# EAGLE design wirelessnode_triac (EAGLE 7.5.0)
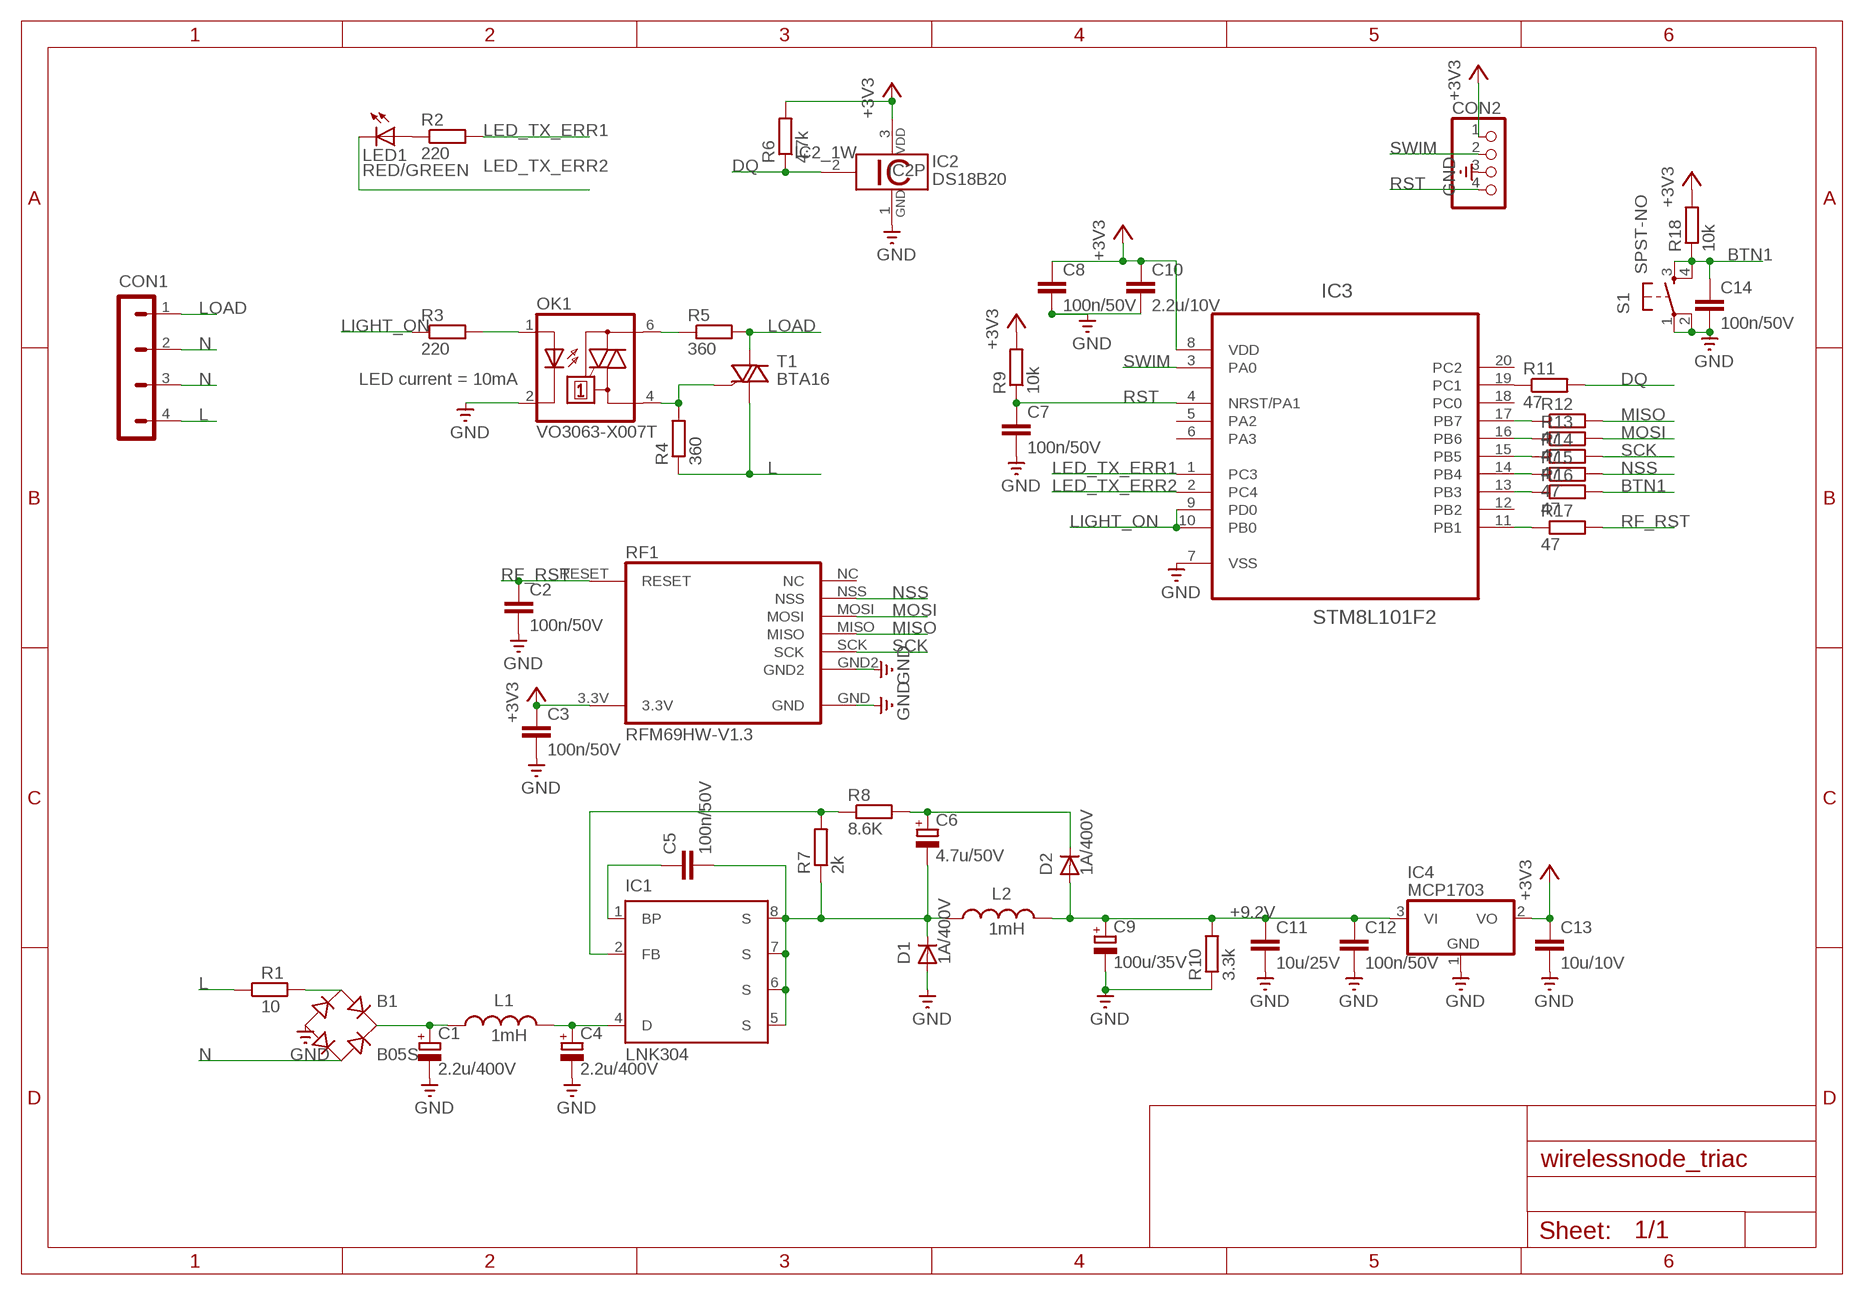
[diagram p0: schematic, sheet 1]

## Parts
B1  B05S  [MBS]
C1  2.2u/400V  C-POL-EUE3.5-8  [E3.5-8]
C2  100n/50V  C-EUC0603K  [C0603K]
C3  100n/50V  C-EUC0603K  [C0603K]
C4  2.2u/400V  C-POL-EUE3.5-8  [E3.5-8]
C5  100n/50V  C-EUC0603K  [C0603K]
C6  4.7u/50V  C-POL-EU  [PANASONIC_C_LARGER_PADS]
C7  100n/50V  C-EUC0603K  [C0603K]
C8  100n/50V  C-EUC0603K  [C0603K]
C9  100u/35V  C-POL-EUPANASONIC_D  [PANASONIC_D_LARGER_PADS]
C10  2.2u/10V  C-EUC0603K  [C0603K]
C11  10u/25V  C-EUC1206  [C1206]
C12  100n/50V  C-EUC0603K  [C0603K]
C13  10u/10V  C-EUC0603K  [C0603K]
C14  100n/50V  C-EUC0603K  [C0603K]
CON1  POWER_CONN_4  [TERMINAL_BLOCK_4]
CON2  ZL321-4P  CON_1X4PIN_1.27MM_SMD  [CON_1X4_1.27_SMD]
D1  1A/400V  US1G-DIO  [DO214-AC]
D2  1A/400V  SL1G  [SOD-123F]
IC1  LNK304  [SO8_NO_PIN3]
IC2  DS18B20  [TO92-]
IC3  STM8L101F2  [TSSOP20]
IC4  MCP1703  MCP1703CB  [SOT23]
L1  1mH  FERROCORE_DE0703-1000  [DE0703]
L2  1mH  FERROCORE_DE0703-1000  [DE0703]
LED1  RED/GREEN  LED5MM  [LED5MM]
OK1  VO3063-X007T  MOC3042S  [DIL6-SMD]
R1  10  R_CF1WS  [CF1WS]
R2  220  R-EU_R0603  [R0603]
R3  220  R-EU_R0603  [R0603]
R4  360  R-EU_R0603  [R0603]
R5  360  R-EU_R0603  [R0603]
R6  4.7k  R-EU_R0603  [R0603]
R7  2k  R-EU_R0603  [R0603]
R8  8.6K  R-EU_R0603  [R0603]
R9  10k  R-EU_R0603  [R0603]
R10  3.3k  R-EU_R0603  [R0603]
R11  47  R-EU_R0603  [R0603]
R12  47  R-EU_R0603  [R0603]
R13  47  R-EU_R0603  [R0603]
R14  47  R-EU_R0603  [R0603]
R15  47  R-EU_R0603  [R0603]
R16  47  R-EU_R0603  [R0603]
R17  47  R-EU_R0603  [R0603]
R18  10k  R-EU_R0603  [R0603]
RF1  RFM69HW-V1.3  [RFM69HW-V1.3-SMD]
S1  SPST-NO  DTSM-63X-V  [DTSM-63X-V-7MM_HEIGHT]
T1  BTA16  BT136SMD  [TO220_SMD]

## Nets
+3V3: C3.1 C8.1 C10.1 C13.1 CON2.1 IC2.3 IC3.8(VDD) IC4.2(VO) R6.2 R9.2 R18.2 RF1.3.3V
+9.2V: C9.+ C11.1 C12.1 D2.2(A) IC4.3(VI) L2.P$2 R10.2
BTN1: C14.1 R16.2 R18.1 S1.3(S) S1.4(S1)
DQ: IC2.2 R6.1 R11.2
GND: B1.- C1.- C2.2 C3.2 C4.- C7.2 C8.2 C9.- C10.2 C11.2 C12.2 C13.2 C14.2 CON2.3 D1.A IC2.1 IC3.7(VSS) IC4.1(GND) OK1.2(C) R10.1 RF1.GND RF1.GND2 S1.1(P) S1.2(P1)
L: CON1.4 R1.1 R4.1 T1.1(A1)
LED_TX_ERR1: IC3.1(PC3) R2.2
LED_TX_ERR2: IC3.2(PC4) LED1.K(C)
LIGHT_ON: IC3.9(PD0) IC3.10(PB0) R3.1
LOAD: CON1.1 R5.2 T1.2(A2)
MISO: R12.2 RF1.MISO
MOSI: R13.2 RF1.MOSI
N: B1.AC2 CON1.2 CON1.3
N$1: C4.+ IC1.4(D) L1.P$2
N$2: LED1.A R2.1
N$3: C6.+ D2.1(C) R8.2
N$4: IC1.2(FB) R7.2 R8.1
N$5: C5.1 IC1.1(BP)
N$6: C5.2 C6.- D1.C IC1.5(S) IC1.6(S) IC1.7(S) IC1.8(S) L2.P$1 R7.1
N$7: OK1.6(A2) R5.1
N$8: OK1.4(A1) R4.2 T1.3(G)
N$9: IC3.14(PB4) R15.1
N$10: B1.+ C1.+ L1.P$1
N$11: OK1.1(A) R3.2
N$12: B1.AC1 R1.2
N$13: IC3.15(PB5) R14.1
N$14: IC3.16(PB6) R13.1
N$15: IC3.17(PB7) R12.1
N$16: IC3.11(PB1) R17.1
N$17: IC3.13(PB3) R16.1
N$18: IC3.19(PC1) R11.1
NSS: R15.2 RF1.NSS
RF_RST: C2.1 R17.2 RF1.RESET
RST: C7.1 CON2.4 IC3.4(NRST/PA1) R9.1
SCK: R14.2 RF1.SCK
SWIM: CON2.2 IC3.3(PA0)
Unconnected: IC3.5(PA2) IC3.6(PA3) IC3.12(PB2) IC3.18(PC0) IC3.20(PC2) RF1.NC

## Notes on the sheet
- LED current = 10mA

## Library data of the parts
B1 = rectifier:B*S: Surface Mount Glass Passivated Bridge Rectifiers Source: Comchip Bridge Rectifiers B05S-G_B10S-G.pdf
C1 C4 = comp_wirelessnode:C-POL-EU; TME_ORDER_NUMBER: RD2G225M0811MBB
C2 C3 C5 C7 C8 C12 C14 = resistor:C-EU: CAPACITOR, European symbol; TME_ORDER_NUMBER: C0603C104K5RAC
C6 = comp_wirelessnode:C-POL-EU; TME_ORDER_NUMBER: RC1H475M05005VR
C9 = comp_wirelessnode:C-POL-EU; TME_ORDER_NUMBER: UCD1V101MCL6GS
C10 = resistor:C-EU: CAPACITOR, European symbol; TME_ORDER_NUMBER: CL10A225KP8NNNC
C11 = resistor:C-EU: CAPACITOR, European symbol; TME_ORDER_NUMBER: 08053D106KAT2A
C13 = resistor:C-EU: CAPACITOR, European symbol; TME_ORDER_NUMBER: 0603ZD106MAT2A
CON1 = CarReceiver:POWER_CONN_4; TME_ORDER_NUMBER: EBBA-02-C-SS-BU
CON2 = comp_wirelessnode:CON_1X4PIN_; TME_ORDER_NUMBER: ZL321-4P (DS1065-01-1X4S8BV)
D1 = comp_wirelessnode:US1G-DIO; TME_ORDER_NUMBER: US1G-DIO
D2 = comp_wirelessnode:SL1G; TME_ORDER_NUMBER: SL1G-DIO
IC1 = comp_wirelessnode:LNK304; TME_ORDER_NUMBER: LNK304DN
IC2 = 1wire:DS18B20: Programmable Resolution Digital Thermometer This chip provides a onewire thermosensor with approx. 0.5°C accuracy. A programmable over/undertemperure alarm is available. The precision can be set from 9..12 bits. Notes: Vdd must be applied for accurate measurements at low temperatures, as the parasite power circuit otherwise heats the sensor. If parasite power is used, Vdd has to be connected to GND. The DS1822 is a low-cost thermometer chip, the DS18S20 is similar to the DS18B20, but with 9 Bit precision only. Author: Jan Kandziora <jjj@gmx.de>
IC3 = comp_wirelessnode:STM8L101F2; TME_ORDER_NUMBER: STM8L101F2P6
IC4 = linear:MCP1703: 250 mA, 16V, Low Quiescent Current LDO Regulator Source: http://ww1.microchip.com/downloads/en/DeviceDoc/22049b.pdf; TME_ORDER_NUMBER: MCP1703T3302ECB
L1 L2 = comp_wirelessnode:FERROCORE_DE0703-1000: FERROCORE SMD Power Coil; TME_ORDER_NUMBER: DE0703-1000
LED1 = led:LED: LED OSRAM: - CHIPLED LG R971, LG N971, LY N971, LG Q971, LY Q971, LO R971, LY R971 LH N974, LH R974 LS Q976, LO Q976, LY Q976 LO Q996 - Hyper CHIPLED LW Q18S LB Q993, LB Q99A, LB R99A - SideLED LS A670, LO A670, LY A670, LG A670, LP A670 LB A673, LV A673, LT A673, LW A673 LH A674 LY A675 LS A676, LA A676, LO A676, LY A676, LW A676 LS A679, LY A679, LG A679 - Hyper Micro SIDELED® LS Y876, LA Y876, LO Y876, LY Y876 LT Y87S - SmartLED LW L88C, LW L88S LB L89C, LB L89S, LG L890 LS L89K, LO L89K, LY L89K LS L896, LA L896, LO L896, LY L896 - TOPLED LS T670, LO T670, LY T670, LG T670, LP T670 LSG T670, LSP T670, LSY T670, LOP T670, LYG T670 LG T671, LOG T671, LSG T671 LB T673, LV T673, LT T673, LW T673 LH T674 LS T676, LA T676, LO T676, LY T676, LB T676, LH T676, LSB T676, LW T676 LB T67C, LV T67C, LT T67C, LS T67K, LO T67K, LY T67K, LW E67C LS E67B, LA E67B, LO E67B, LY E67B, LB E67C, LV E67C, LT E67C LW T67C LS T679, LY T679, LG T679 LS T770, LO T770, LY T770, LG T770, LP T770 LB T773, LV T773, LT T773, LW T773 LH T774 LS E675, LA E675, LY E675, LS T675 LS T776, LA T776, LO T776, LY T776, LB T776 LHGB T686 LT T68C, LB T68C - Hyper Mini TOPLED® LB M676 - Mini TOPLED Santana® LG M470 LS M47K, LO M47K, LY M47K Source: http://www.osram.convergy.de LUXEON: - LUMILED® LXK2-PW12-R00, LXK2-PW12-S00, LXK2-PW14-U00, LXK2-PW14-V00 LXK2-PM12-R00, LXK2-PM12-S00, LXK2-PM14-U00 LXK2-PE12-Q00, LXK2-PE12-R00, LXK2-PE12-S00, LXK2-PE14-T00, LXK2-PE14-U00 LXK2-PB12-K00, LXK2-PB12-L00, LXK2-PB12-M00, LXK2-PB14-N00, LXK2-PB14-P00, LXK2-PB14-Q00 LXK2-PR12-L00, LXK2-PR12-M00, LXK2-PR14-Q00, LXK2-PR14-R00 LXK2-PD12-Q00, LXK2-PD12-R00, LXK2-PD12-S00 LXK2-PH12-R00, LXK2-PH12-S00 LXK2-PL12-P00, LXK2-PL12-Q00, LXK2-PL12-R00 Source: www.luxeon.com KINGBRIGHT: KA-3528ASYC Source: www.kingbright.com; TME_ORDER_NUMBER: L-57EGW
OK1 = optocoupler:MOC30*: 6-Pin DIP Zero-Cross Optoisolators Triac Driver Output (250/400 Volt Peak) Source: Data sheet <http://www.fairchildsemi.com/ds/MO/MOC3031M.pdf> The old path of data sheet not more available 2013-05-06.; MF: FAIRCHILD SEMICONDUCTOR; MPN: MOC3042SM; OC_FARNELL: unknown; OC_NEWARK: 34C1339; TME_ORDER_NUMBER: VO3063-X007T
R1 = comp_wirelessnode:R_; TME_ORDER_NUMBER: CF1WS-10R
R2-R6 R9 R11-R18 = resistor:R-EU_: RESISTOR, European symbol
R7 = resistor:R-EU_: RESISTOR, European symbol; TME_ORDER_NUMBER: RC0603FR-072K
R8 = resistor:R-EU_: RESISTOR, European symbol; TME_ORDER_NUMBER: CRCW06038K66FKTABC
R10 = resistor:R-EU_: RESISTOR, European symbol; TME_ORDER_NUMBER: RC0603FR-073K3
RF1 = comp_wirelessnode:RFM69HW-V1.3; TME_ORDER_NUMBER: RFM69HW-868S2
S1 = comp_wirelessnode:DTSM-63X-V; TME_ORDER_NUMBER: DTSM-63N-V-B
T1 = comp_wirelessnode:BT136; TME_ORDER_NUMBER: BTA16-600BRG

## Net classes
0 default: clearance 0.205 mm

## Board
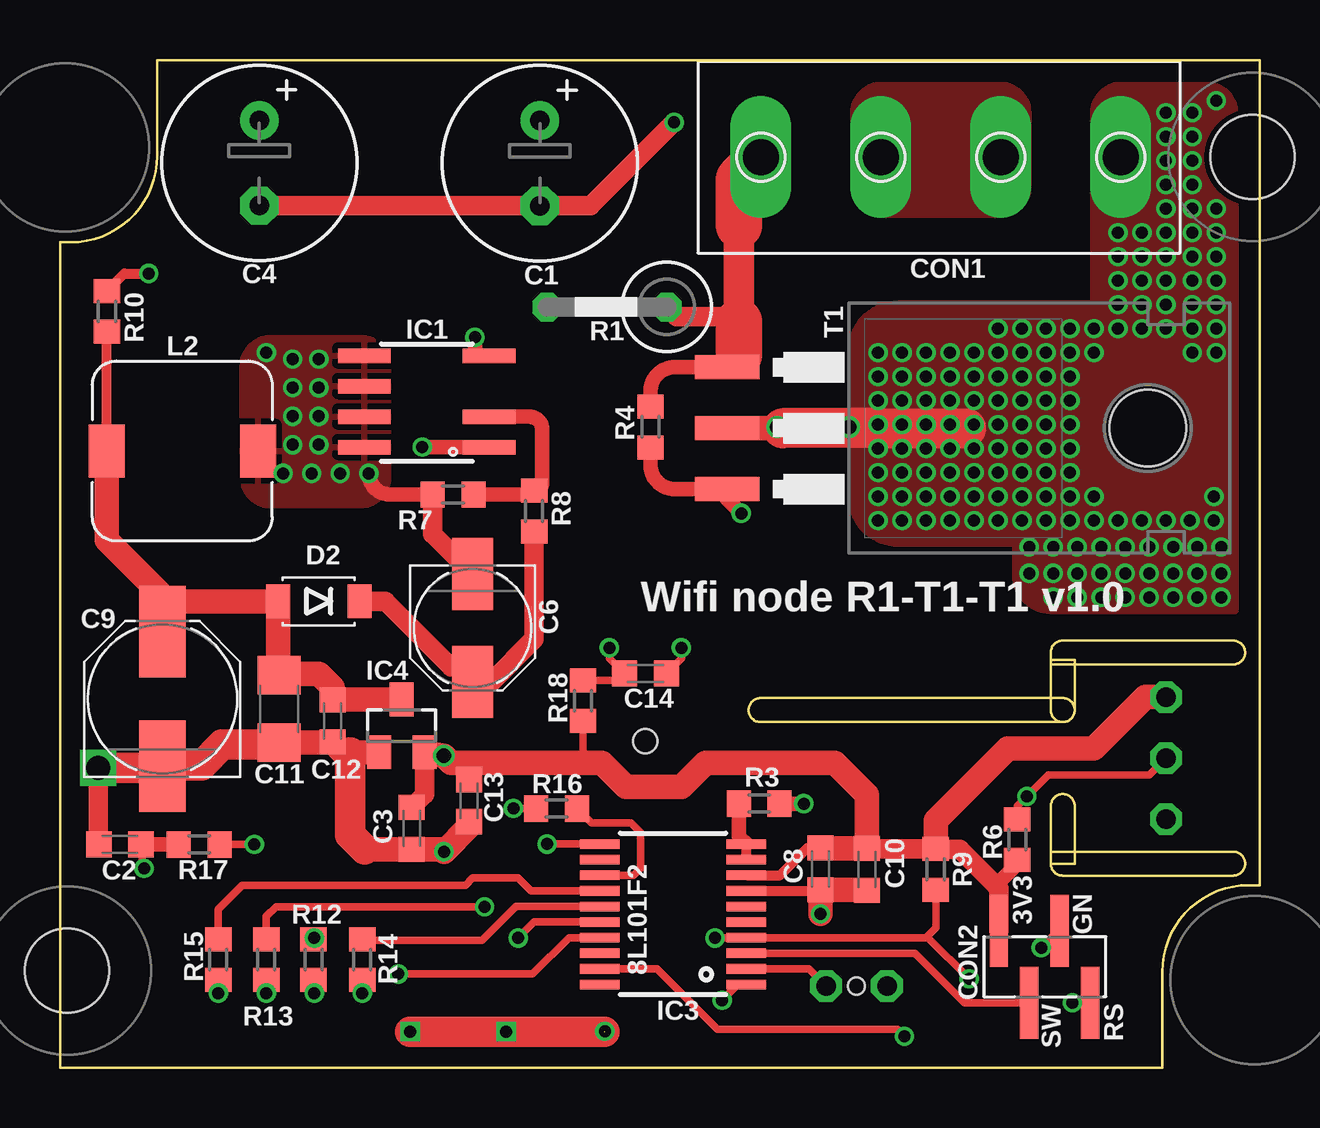
[diagram p1: board, top side]
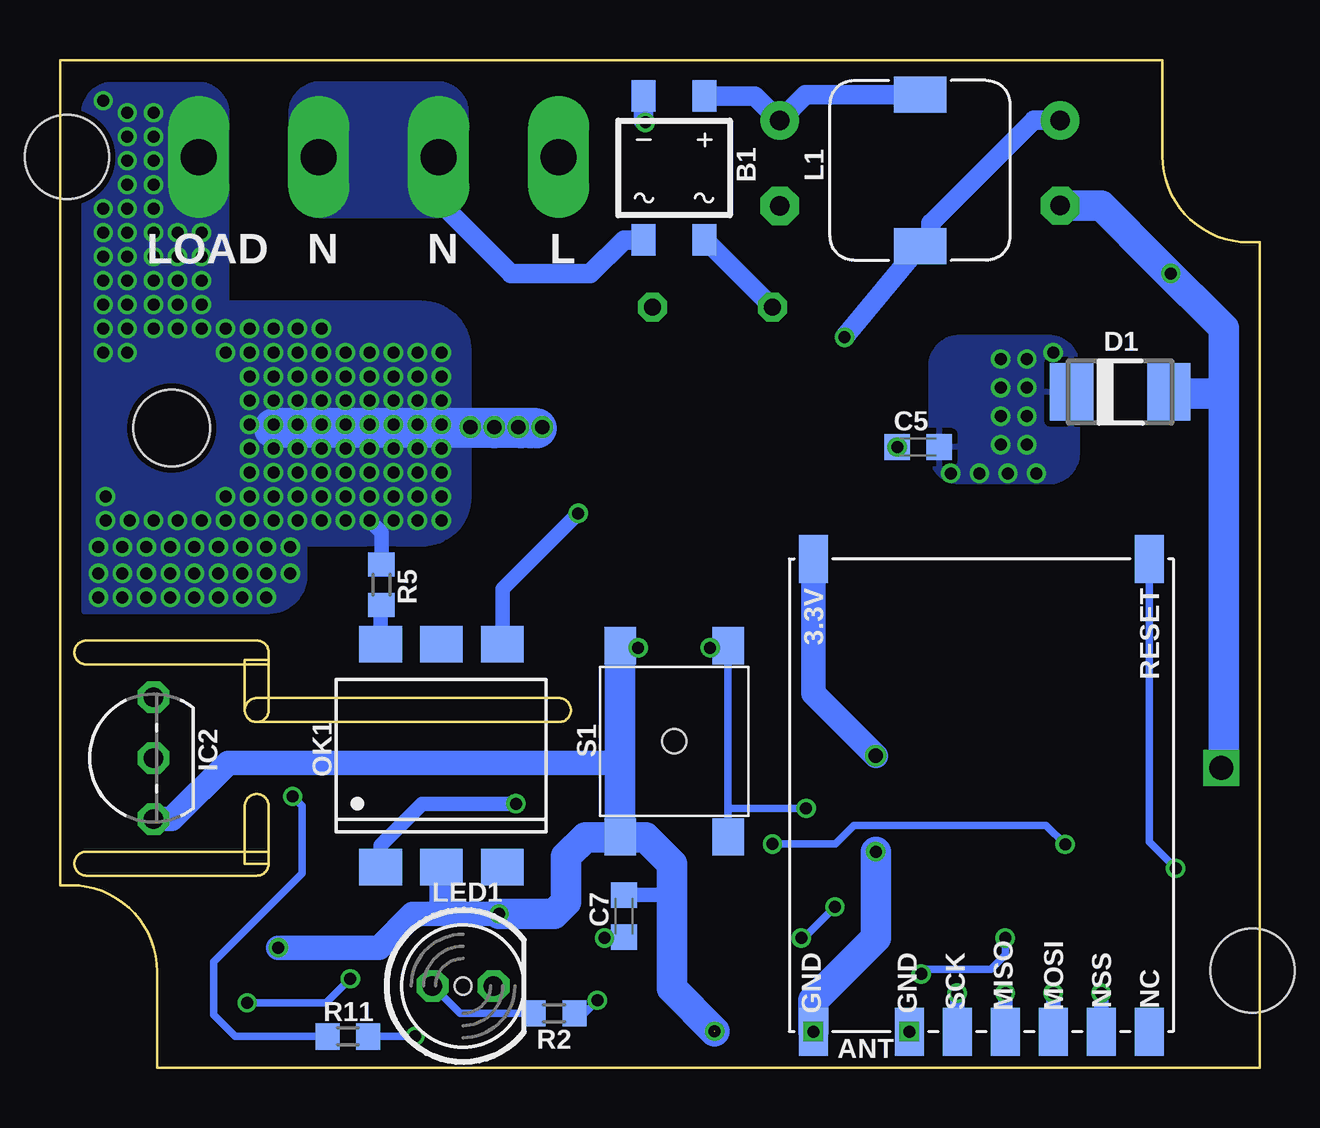
[diagram p2: board, bottom side, seen from below]

Size 50 x 42 mm. Coordinates in mm from the lower left corner, seen from the top.
Outline: 4.05,42 4.05,38 arc-90 0.45,34.4 0,34.4 0,0 45.95,0 45.95,4 arc-90 49.55,7.6 50,7.6 50,42 4.05,42
Copper layers (1*16): Top 0.035mm / dielectric 1.5mm / Bottom 0.035mm
Design rules "SeeedStudio_2layer_DRU_no_angle_20140221": minimum track width 6mil, minimum drill 12mil, track to track 6mil, track to pad 6mil, pad to pad 6mil, via to via 6mil, smd to smd 0mil, copper to edge 10mil, drill to drill 10mil, minimum pad ring 10mil, minimum via ring 6mil, stop-mask expansion 2mil, vias tented up to drill 100mil, thermal gap 10mil
Holes 3.5 mm at 49.7,37.95 0.3,4.05
Holes 1 mm at 24.4,13.6
Holes 0.7 mm at 33.2,3.4
Milling: area 41.3,16.8 to 49.4,17.8; area 41.3,14.4 to 42.3,17; area 41.3,8 to 49.4,9; area 41.3,8.5 to 42.3,11.4; area 28.7,14.4 to 42.3,15.4

### Footprints (pad centres in the part's own frame; a part is rotated, then mirrored left to right if it is on the bottom)
MBS = smd 1 x 1.3: + -1.27,-3; - 1.27,-3; AC1 -1.27,3; AC2 1.27,3
E3.5-8 = drill 0.813 pad 1.6: + -1.778,0 | drill 0.813 pad 1.6 octagon: - 1.778,0
C0603K = smd 1.05 x 1.08: 1 -0.875,0; 2 0.875,0
PANASONIC_C_LARGER_PADS = smd 3 x 1.7: + 2.25,0; - -2.25,0
PANASONIC_D_LARGER_PADS = smd 3.81 x 1.93: + 2.8,0; - -2.8,0
C1206 = smd 1.6 x 1.8: 1 -1.4,0; 2 1.4,0
TERMINAL_BLOCK_4 = drill 1.5 pad 2.54 long: 1 0,7.58; 2 0,2.58; 3 0,-2.42; 4 0,-7.42
CON_1X4_1.27_SMD = smd 0.76 x 3: 1 -1.27,1.5; 2 0,-1.5; 3 1.27,1.5; 4 2.54,-1.5
DO214-AC = smd 1.8 x 2.4: A 2.025,0; C -2.025,0
SOD-123F = smd 1 x 1.4: 1 -1.7,0; 2 1.7,0
SO8_NO_PIN3 = smd 0.6 x 2.2: 1 -1.905,-2.6; 2 -0.635,-2.6; 4 1.905,-2.6; 5 1.905,2.6; 6 0.635,2.6; 7 -0.635,2.6; 8 -1.905,2.6
TO92- = drill 0.813 octagon: 1 -2.54,0; 2 0,0; 3 2.54,0
TSSOP20 = smd 0.4 x 1.65: 1 -3.575,-3.05; 2 -2.925,-3.05; 3 -2.275,-3.05; 4 -1.625,-3.05; 5 -0.975,-3.05; 6 -0.325,-3.05; 7 0.325,-3.05; 8 0.975,-3.05; 9 1.625,-3.05; 10 2.275,-3.05; 11 2.275,3.05; 12 1.625,3.05; 13 0.975,3.05; 14 0.325,3.05; 15 -0.325,3.05; 16 -0.975,3.05; 17 -1.625,3.05; 18 -2.275,3.05; 19 -2.925,3.05; 20 -3.575,3.05
SOT23 = smd 1 x 1.4: 1 -0.95,-1.1; 2 0.95,-1.1; 3 0,1.1
DE0703 = smd 2.2 x 1.5: P$1 0,3.15; P$2 0,-3.15
LED5MM = drill 0.813 octagon: A -1.27,0; K 1.27,0
DIL6-SMD = smd 1.78 x 1.52: 1 -2.54,-4.645; 2 0,-4.645; 3 2.54,-4.645; 4 2.54,4.645; 5 0,4.645; 6 -2.54,4.645
CF1WS = drill 0.7 octagon: 1 0,0; 2 5,0
R0603 = smd 1 x 1.1: 1 -0.85,0; 2 0.85,0
RFM69HW-V1.3-SMD = smd 2 x 1.2: 3.3V 0,1; GND 19.7,1; GND2 19.7,5; MISO 19.7,9; MOSI 19.7,11; NC 19.7,15; NSS 19.7,13; RESET 0,15; SCK 19.7,7
DTSM-63X-V-7MM_HEIGHT = smd 1.55 x 1.3: 1 -3.987,2.25; 2 3.987,2.25; 3 -3.987,-2.25; 4 3.987,-2.25
TO220_SMD = smd 1 x 2.7: 1 -2.54,-7.72; 2 0,-7.72; 3 2.54,-7.72 | hole 3.2: 0,9.806

### Placement (x,y rotation side)
B1  24.4,37.5 180 bottom
C1  20,37.7 270 top
C2  2.5,9.3 180 top
C3  14.66,9.97 270 top
C4  8.31,37.71 270 top
C5  14.23,25.86 0 bottom
C6  17.2,18.32 270 top
C7  26.49,6.32 90 bottom
C8  31.7,8.28 270 top
C9  4.27,15.36 90 top
C10  33.63,8.26 270 top
C11  9.13,14.95 270 top
C12  11.36,14.45 270 top
C13  17.05,11.13 270 top
C14  24.4,16.43 0 top
CON1  36.63,37.95 270 top
CON2  40.4,4.2 0 top
D1  5.81,28.16 0 bottom
D2  10.78,19.43 180 top
IC1  15.29,27.77 90 top
IC2  46.1,12.9 90 bottom
IC3  25.55,7.04 90 top
IC4  14.24,14.24 0 top
L1  14.15,37.4 0 bottom
L2  5.1,25.7 270 top
LED1  33.2,3.4 0 bottom
OK1  34.1,13 0 bottom
R1  25.3,31.7 180 top
R2  29.41,2.26 0 bottom
R3  29.14,11.01 0 top
R4  24.61,26.7 270 top
R5  36.6,20.12 90 bottom
R6  39.9,9.5 270 top
R7  16.39,23.89 0 top
R8  19.77,23.2 270 top
R9  36.5,8.26 90 top
R10  1.96,31.52 270 top
R11  38,1.3 180 bottom
R12  10.57,4.5 270 top
R13  8.6,4.5 270 top
R14  12.6,4.5 270 top
R15  6.6,4.5 270 top
R16  20.7,10.8 180 top
R17  5.8,9.3 180 top
R18  21.8,15.29 270 top
RF1  19.6,21.2 270 bottom
S1  24.4,13.6 90 bottom
T1  35.53,26.65 270 top

### Tracks (layer width: path | path; a pad name or v marks a point on that pad's centre or on a via)
+3V3  (via drill 0.6)
  Top 0.305: R18.2 21.8,12.7
  Top 0.406: IC3.8 30.02,8.02 31.15,9.15 C8.1
  Top 0.61: R6.2 39.9,8.5 39,7.6
  Top 0.813: IC4.2 15.19,11.38 C3.1 | C10.1 33.66,9.11 R9.2 37.5,9.1 39,7.6 39.13,7.47 CON2.1
  Top 1.016: IC4.2 v16,13 16.3,12.7 17.1,12.7 | 17.1,12.7 21.8,12.7 22.6,12.7 23.6,11.7 25.9,11.7 26.9,12.7 32.3,12.7 33.63,11.37 C10.1 31.72,9.14 C8.1 | C13.1 17.05,12.65 17.1,12.7 | IC2.3 45.24,15.44 43.1,13.3 39.5,13.3 36.5,10.3 R9.2
  Bottom 1.016: RF1.3.3V 18.6,15.6 v16,13
+9.2V
  Top 0.406: L2.P$2 R10.2
  Top 0.61: C9.+ 4.34,19.06 4.34,19.27 4.5,19.43
  Top 1.016: IC4.3 11.38,15.34 C12.1 11.36,15.84 10.8,16.4 9.19,16.4 C11.1 9.08,16.35 D2.2 4.5,19.43 1.95,21.98 L2.P$2
BTN1  (via drill 0.5)
  Top 0.305: v18.9,10.8 R16.2 | v22.9,17.5 22.9,17.05 C14.1 23.25,16.14 R18.1
  Bottom 0.305: 22.15,10.8 S1.4 22.81,17.59 v22.9,17.5 | 22.15,10.8 S1.3 22.15,9.4 | v18.9,10.8 22.15,10.8
DQ  (via drill 0.5)
  Top 0.305: IC2.2 45.4,12.2 41.2,12.2 v40.3,11.3 39.9,10.9 R6.1
  Bottom 0.305: R11.2 42.7,1.3 43.6,2.2 43.6,4.4 39.9,8.1 39.9,10.9 v40.3,11.3
GND  (via drill 0.5, 1)  (1 unrouted)
  Top 0.305: CON2.3 41.6,5.7 v40.9,5 | C14.2 25.9,17.05 v25.9,17.5
  Top 0.406: IC4.1 13.29,13.19 13.3,13.2 | R10.1 2.69,33.1 v3.7,33.1 | IC3.7 31.36,7.37 C8.2
  Top 0.813: v1.6,12.5 1.6,9.32 C2.2 | C4.- C1.- 22.12,35.92 v25.6,39.4
  Top 1.016: 9.05,13.46 C11.2 11.33,13.55 C12.2 11.79,13.14 12.1,13.14 IC4.1 | 12.7,9.1 C3.2 15.9,9.1 v16,9 17.05,10.05 C13.2 | v31.7,6.4 C8.2 33.61,7.4 C10.2
  Top 1.27: 9.05,13.46 6.76,13.46 5.9,12.6 4.31,12.6 C9.- | v1.6,12.5 4.21,12.5 | 12.7,9.1 12.1,9.7 12.1,13.14 | RF1.GND2 RF1.GND v22.7,1.5
  Top 1.422: 4.21,12.5 C9.-
  Bottom 0.305: S1.2 25.99,17.59 v25.9,17.5
  Bottom 0.406: v3.7,33.1 4.16,33.56 4.24,33.56
  Bottom 0.61: 1.49,22.04 1.49,22.1 | C7.2 24.51,7.19 24.5,7.2
  Bottom 0.813: B1.- 25.67,39.47 v25.6,39.4
  Bottom 1.016: 26.69,9.65 S1.1 | v31.7,6.4 34.1,6.4 | 34.1,6.4 35.3,6.4 36.7,5 v40.9,5 | OK1.2 34.1,6.4 | IC2.1 45.34,10.36 43,12.7 26.65,12.7 | 26.75,13 26.65,12.9
  Bottom 1.27: 1.49,28.1 1.49,22.1 1.49,12.61 v1.6,12.5 | 1.49,28.1 1.49,30.82 4.24,33.56 6.6,35.93 C4.- | D1.A 3.72,28.1 1.49,28.1 | S1.2 26.65,12.9 26.65,12.7 S1.1 | v16,9 16,5.4 18.6,2.8 RF1.GND | v22.71,1.51 24.5,3.3 24.5,7.2 24.5,8.5 25.6,9.6 26.64,9.6 S1.1 | v31.7,6.4 29.4,6.4 28.9,6.9 28.9,8.8 28.1,9.6 26.66,9.6 S1.1
  other vias: 14.6,1.5 18.6,1.5
L
  Top 0.61: T1.1 25.61,29.19 arc90 24.61,28.19 R4.1
  Top 0.813: 28.3,29.69 28.3,29.19 T1.1 | R1.1 25.7,31.3 28.3,31.3
  Top 1.27: 28.3,35.1 28.3,31.3 28.3,31.1
  Top 1.93: CON1.4 28.3,37.04 28.3,35.1 | 28.3,31.1 28.3,29.69
LED_TX_ERR1  (via drill 0.5)
  Top 0.305: IC3.1 28.27,3.46 v27.6,2.8
  Bottom 0.305: v27.6,2.8 28.14,2.26 R2.2
LED_TX_ERR2
  Top 0.305: IC3.2 31.21,4.12 LED1.K
LIGHT_ON
  Top 0.406: IC3.9 IC3.10
  Top 0.61: IC3.10 28.3,9.62 R3.1
LOAD  (via drill 0.5, 0.6)
  Top 1.016: 34.17,26.63 arc-90 34.2,26.65 | 30.12,26.65 T1.2 arc-90 T1.2
  Top 1.676: 37.77,26.65 34.2,26.65 34.15,26.65 30.12,26.65
  Bottom 0.61: R5.2 36.6,22.3 v37.1,22.8 | v31.9,26.7 31.9,26.65 | v30.9,26.7 arc45 30.81,26.66 30.8,26.65 | v29.9,26.7 29.9,26.65 30.39,26.65 arc45 30.4,26.65
  Bottom 1.676: 30.12,26.65 30.4,26.65 30.8,26.65 31.9,26.65 41.07,26.65
  other vias: 34.1,29.8 35.1,29.8 36.1,29.8 37.1,29.8 38.1,29.8 39.1,29.8 40.1,29.8 41.1,29.8 42.1,29.8 34.1,28.8 35.1,28.8 36.1,28.8 37.1,28.8 38.1,28.8 39.1,28.8 40.1,28.8 41.1,28.8 42.1,28.8 34.1,27.8 35.1,27.8 36.1,27.8 37.1,27.8 38.1,27.8 39.1,27.8 40.1,27.8 41.1,27.8 42.1,27.8 34.1,26.8 35.1,26.8 36.1,26.8 37.1,26.8 38.1,26.8 39.1,26.8 40.1,26.8 41.1,26.8 42.1,26.8 34.1,25.8 35.1,25.8 36.1,25.8 37.1,25.8 38.1,25.8 39.1,25.8 40.1,25.8 41.1,25.8 42.1,25.8 34.1,24.8 35.1,24.8 36.1,24.8 37.1,24.8 38.1,24.8 39.1,24.8 40.1,24.8 41.1,24.8 42.1,24.8 34.1,23.8 35.1,23.8 36.1,23.8 37.1,23.8 38.1,23.8 39.1,23.8 40.1,23.8 41.1,23.8 42.1,23.8 34.1,22.8 35.1,22.8 36.1,22.8 38.1,22.8 39.1,22.8 40.1,22.8 41.1,22.8 42.1,22.8 40.4,21.7 41.4,21.7 42.4,21.7 43.4,21.7 44.4,21.7 45.4,21.7 46.4,21.7 47.4,21.7 48.4,21.7 40.4,20.6 41.4,20.6 42.4,20.6 43.4,20.6 44.4,20.6 45.4,20.6 46.4,20.6 47.4,20.6 41.4,19.6 42.4,19.6 43.4,19.6 44.4,19.6 45.4,19.6 46.4,19.6 47.4,19.6 48.4,20.6 48.4,19.6 43.1,22.8 44.1,22.8 43.1,23.8 42.1,30.8 41.1,30.8 40.1,30.8 39.1,30.8 43.1,29.8 43.1,30.8 44.1,30.8 48.1,22.8 47.2,30.8 45.1,30.8 46.1,30.8 48.1,23.8 47.1,22.8 46.1,22.8 45.1,22.8 48.2,30.8 48.2,29.8 47.2,29.8 44.1,32.8 45.1,32.8 46.1,32.8 47.2,32.8 48.2,32.8 48.2,31.8 47.2,31.8 46.1,31.8 45.1,31.8 44.1,31.8 44.1,33.8 45.1,33.8 46.1,33.8 47.2,33.8 48.2,33.8 48.2,34.8 47.2,34.8 46.1,34.8 45.1,34.8 46.1,35.8 47.2,35.8 48.2,35.8 47.2,36.8 46.1,36.8 46.1,37.8 47.2,37.8 47.2,38.8 48.2,40.3 47.2,39.8 46.1,39.8 46.1,38.8 44.1,34.8 32.9,26.7
  pour Bottom: 47.97,31.88 34.95,31.88 arc90 32.95,29.88 32.95,23.8 arc90 34.95,21.8 39.8,21.8 39.8,20.5 arc90 41.3,19 49,19 49,30.88 arc90
  pour Top: 49,30.88 49,19 41.3,19 arc-90 39.8,20.5 39.8,21.8 34.95,21.8 arc-90 32.95,23.8 32.95,29.88 arc-90 34.95,31.88 47.97,31.88 arc-90
  pour Top (no thermals): 43.05,30.5 43.05,39.8 arc-90 44.25,41 47.8,41 arc-90 49,39.8 49,30.5
  pour Bottom (no thermals): 49,30.5 49,39.8 arc90 47.8,41 44.25,41 arc90 43.05,39.8 43.05,30.5
MISO  (via drill 0.5)
  Top 0.61: R12.2 10.57,3.13 v10.6,3.1
  Bottom 0.61: RF1.MISO v10.6,3.1
MOSI  (via drill 0.5)
  Top 0.61: R13.2 v8.6,3.1
  Bottom 0.61: RF1.MOSI v8.6,3.1
N
  Bottom 0.813: CON1.3 34.21,36.11 31.2,33.1 27.9,33.1 26.5,34.5 B1.AC2
  pour Bottom (no thermals): 40.38,39.8 40.38,36.72 arc-90 39.18,35.52 34.25,35.52 arc-90 33.05,36.72 33.05,39.8 arc-90 34.25,41 39.18,41 arc-90
  pour Top (no thermals): 40.38,39.8 40.38,36.72 arc-90 39.18,35.52 34.25,35.52 arc-90 33.05,36.72 33.05,39.8 arc-90 34.25,41 39.18,41 arc-90
N$1  (via drill 0.5 pad 0.81)
  Top 0.61: v17.29,30.44 17.29,29.67 IC1.4
  Bottom 0.813: 14.1,34.3 L1.P$2 | L1.P$2 v17.29,30.44 | C4.+ 9.41,39.48 13.7,35.2 13.7,34.7 L1.P$2
N$2
  Bottom 0.305: R2.1 33.33,2.26 LED1.A
N$3
  Top 0.813: R8.2 19.77,17.87 18,16.1 17.23,16.1 C6.+ 16.57,16.7 16.3,16.7 13.57,19.43 D2.1
N$4
  Top 0.61: 19.87,23.86 R8.1 | 19.85,24.05 R8.1 | R7.2 19.6,23.89 R8.1 | IC1.2 19.57,27.13 arc-90 20.1,26.6 20.1,24.39 arc-90 R8.1
N$5  (via drill 0.5)
  Top 0.61: IC1.1 | IC1.1 | IC1.1 16.14,25.86 arc45 16.14,25.86 C5.1
  other vias: 15.1,25.86
N$6  (via drill 0.5)
  Top 0.406: IC1.5
  Top 0.61: IC1.8 | R7.1 13.76,23.89 arc-90 v12.87,24.77
  Top 0.813: R7.1 15.54,22.23 C6.-
  other vias: 11.68,24.77 9.7,29.53 9.3,24.77 9.7,25.96 9.7,27.15 9.7,28.34 10.79,29.53 10.49,24.77 10.79,25.96 10.79,27.15 10.79,28.34 8.6,29.8
  pour Top: 12.5,23.4 8.8,23.4 arc-90 7.6,24.6 7.6,29.25 arc-90 8.8,30.45 12.5,30.45 arc-90 13.7,29.25 13.7,24.6 arc-90
  pour Bottom: 8.8,24.4 12.5,24.4 arc90 13.7,25.6 13.7,29.25 arc90 12.5,30.45 8.8,30.45 arc90 7.6,29.25 7.6,25.6 arc90
N$7
  Bottom 0.61: OK1.6 36.64,19.23 R5.1
N$8  (via drill 0.5)
  Top 0.61: R4.2 24.61,25.11 arc90 25.61,24.11 T1.3 27.81,23.69 v28.4,23.1
  Bottom 0.61: OK1.4 31.56,19.94 v28.4,23.1
N$9
  Top 0.305: IC3.14 19.64,7.37 19.1,7.9 17.2,7.9 16.9,7.6 7.6,7.6 6.6,6.6 R15.1
N$10
  Bottom 0.813: L1.P$1 18.93,40.55 C1.+ 21.02,40.5 B1.+
N$11  (via drill 0.5)
  Top 0.61: R3.2 v31,11
  Bottom 0.61: OK1.1 36.64,9.26 34.9,11 v31,11
N$12
  Bottom 0.813: B1.AC1 23.1,34.5 R1.2
N$13
  Top 0.305: IC3.15 19.02,6.71 17.6,5.3 12.65,5.3
  Top 0.406: 12.6,5.3 R14.1 12.65,5.3
N$14  (via drill 0.5)
  Top 0.305: R13.1 8.6,6.3 9,6.7 v17.7,6.7 | IC3.16 19.77,6.07 v19.1,5.4
  Bottom 0.305: v19.1,5.4 19,5.4 v17.7,6.7
N$15  (via drill 0.5)
  Top 0.305: IC3.17 21.21,5.42 19.7,3.9 v14.1,3.9
  Top 0.406: R12.1 10.57,5.37 v10.6,5.4
  Bottom 0.305: v14.1,3.9 13.9,4.1 11.2,4.1 10.6,4.7 v10.6,5.4
N$16  (via drill 0.5)
  Top 0.305: IC3.11 v20.3,9.31 | v8.1,9.3 R17.1
  Bottom 0.305: v20.3,9.31 17.68,9.31 16.9,10.1 8.9,10.1 v8.1,9.3
N$17
  Top 0.305: 22.52,8 IC3.13 23.91,8.02 24.2,8.3 24.2,9.8 23.8,10.2 22.15,10.2 R16.1
N$18  (via drill 0.5)
  Top 0.305: IC3.19 24.89,4.12 27.4,1.6 34.9,1.6 v35.2,1.3
  Bottom 0.305: v35.2,1.3 R11.1
NSS  (via drill 0.5)
  Top 0.61: R15.2 v6.6,3.1
  Bottom 0.61: RF1.NSS v6.6,3.1
RF_RST  (via drill 0.5)
  Top 0.305: 3.42,9.25 3.42,8.38 v3.5,8.3
  Top 0.61: 3.42,9.25 C2.1 R17.2
  Bottom 0.305: RF1.RESET 4.6,9.4 v3.5,8.3
RST  (via drill 0.5)
  Top 0.305: CON2.4 v42.2,2.7 | 36.1,5.42 IC3.4 27.32,5.42 v27.3,5.4 | 36.1,5.42 36.19,5.42 v37.9,3.7 | R9.1 36.5,5.82 36.1,5.42
  Bottom 0.305: v37.9,3.7 38.9,2.7 v42.2,2.7
  Bottom 0.61: C7.1 27.26,5.44 v27.3,5.4
SCK  (via drill 0.5)
  Top 0.61: R14.2 v12.6,3.1
  Bottom 0.61: RF1.SCK v12.6,3.1
SWIM
  Top 0.305: IC3.3 35.63,4.76 37.7,2.7 CON2.2

### Text on the board
tPlace: Wifi node R1-T1-T1 v1.0 | 3V3 | GN | 8L101F2 | SW | RS
bPlace: L | N | N | LOAD